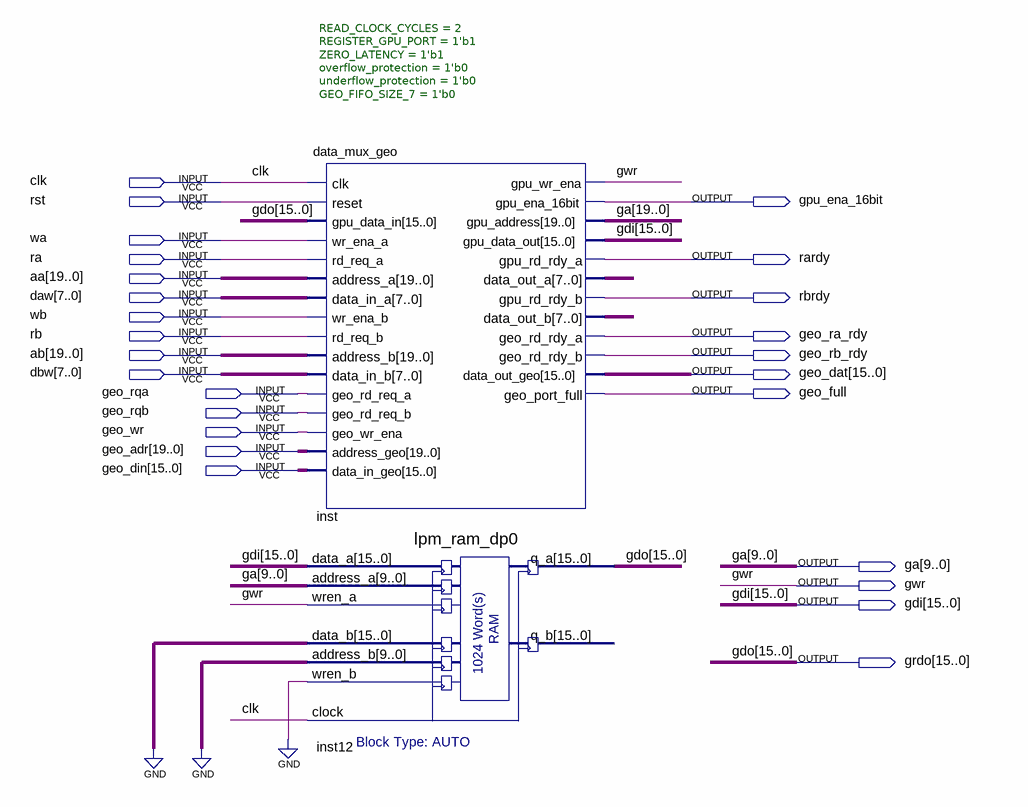
[diagram p0: schematic sheet]
// Quartus schematic Top.bdf as structural Verilog: 2 symbols, 26 pins
module Top (
  input  clk,
  input  rst,
  input  wa,
  input  ra,
  input  [19:0] aa,
  input  [7:0] daw,
  input  wb,
  input  rb,
  input  [19:0] ab,
  input  [7:0] dbw,
  input  geo_rqa,
  input  geo_rqb,
  input  geo_wr,
  input  [19:0] geo_adr,
  input  [15:0] geo_din,
  output gpu_ena_16bit,
  output rardy,
  output rbrdy,
  output geo_ra_rdy,
  output geo_rb_rdy,
  output [15:0] geo_dat,
  output geo_full,
  output [19:0] ga,
  output gwr,
  output [15:0] gdi,
  output [15:0] grdo
);

  wire [7:0] inst_data_out_a, inst_data_out_b;

  data_mux_geo #(.READ_CLOCK_CYCLES(2), .REGISTER_GPU_PORT(1'b1), .ZERO_LATENCY(1'b1), .overflow_protection(1'b0), .underflow_protection(1'b0), .GEO_FIFO_SIZE_7(1'b0)) inst (
    .clk(clk), .reset(rst), .gpu_data_in(grdo), .wr_ena_a(wa), .rd_req_a(ra), .address_a(aa),
    .data_in_a(daw), .wr_ena_b(wb), .rd_req_b(rb), .address_b(ab), .data_in_b(dbw), .geo_rd_req_a(geo_rqa),
    .geo_rd_req_b(geo_rqb), .geo_wr_ena(geo_wr), .address_geo(geo_adr), .data_in_geo(geo_din),
    .gpu_wr_ena(gwr), .gpu_ena_16bit(gpu_ena_16bit), .gpu_address(ga), .gpu_data_out(gdi),
    .gpu_rd_rdy_a(rardy), .data_out_a(inst_data_out_a), .gpu_rd_rdy_b(rbrdy), .data_out_b(inst_data_out_b),
    .geo_rd_rdy_a(geo_ra_rdy), .geo_rd_rdy_b(geo_rb_rdy), .data_out_geo(geo_dat), .geo_port_full(geo_full));
  lpm_ram_dp0 inst12 (
    .data_a(gdi), .address_a(ga[9:0]), .wren_a(gwr), .data_b({16{1'b0}}), .address_b({10{1'b0}}),
    .wren_b(1'b0), .clock(clk), .q_a(grdo));  // open: q_b

  // Other names for the same wires on the sheet: gdo[15:0] = grdo
endmodule
